# EAGLE design CoffeeRoaster (EAGLE 9.2.2)
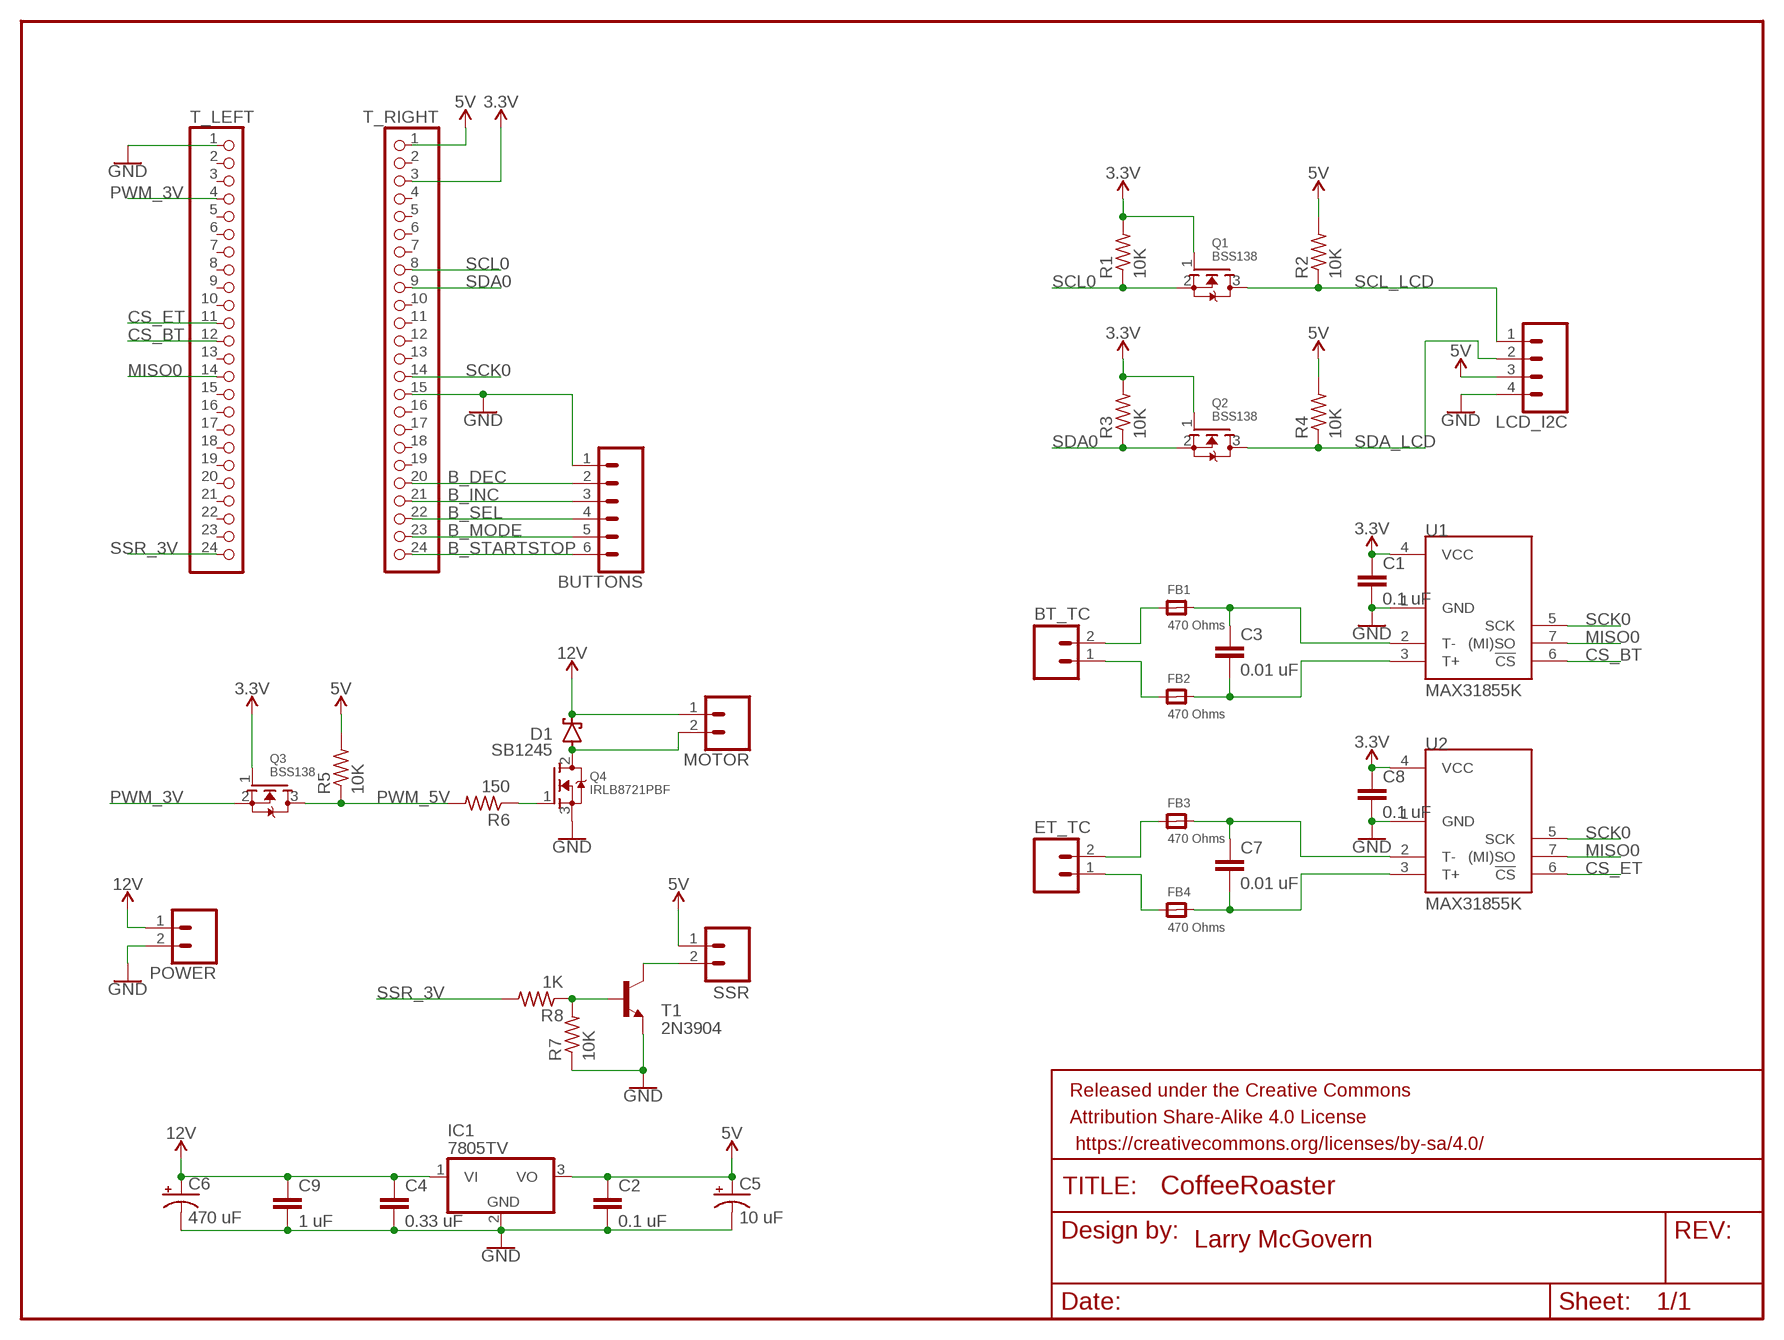
[diagram p0: schematic, sheet 1]

## Parts
BT_TC  M025MM  [SCREWTERMINAL-5MM-2]
BUTTONS  CONN_06SILK_FEMALE_PTH  [1X06]
C1  0.1 uF  C-EU050-025X075  [C050-025X075]
C2  0.1 uF  C-EU050-025X075  [C050-025X075]
C3  0.01 uF  C-EU050-025X075  [C050-025X075]
C4  0.33 uF  C-EU050-025X075  [C050-025X075]
C5  10 uF  CPOL-USE2.5-6  [E2,5-6]
C6  470 uF  CPOL-USE5-10.5  [E5-10,5]
C7  0.01 uF  C-EU050-025X075  [C050-025X075]
C8  0.1 uF  C-EU050-025X075  [C050-025X075]
C9  1 uF  C-EU050-025X075  [C050-025X075]
D1  SB1245  SCHOTTKY-DIODEDO201T15  [DO201T15]
ET_TC  M025MM  [SCREWTERMINAL-5MM-2]
FB1  470 Ohms  FERRITE_0805  [_0805]
FB2  470 Ohms  FERRITE_0805  [_0805]
FB3  470 Ohms  FERRITE_0805  [_0805]
FB4  470 Ohms  FERRITE_0805  [_0805]
FRAME1  FRAME-LETTER  [CREATIVE_COMMONS]
IC1  7805TV  [TO220V]
LCD_I2C  CONN_04  [1X04]
MOTOR  CONN_02PTH4  [1X02_XTRA_BIG]
POWER  CONN_02PTH4  [1X02_XTRA_BIG]
Q1  BSS138  MOSFET-NREFLOW  [SOT23]
Q2  BSS138  MOSFET-NREFLOW  [SOT23]
Q3  BSS138  MOSFET-NREFLOW  [SOT23]
Q4  IRLB8721PBF  MOSFET-NGDS_TO220V  [TO220V]
R1  10K  R-US_0207/10  [0207/10]
R2  10K  R-US_0207/10  [0207/10]
R3  10K  R-US_0207/10  [0207/10]
R4  10K  R-US_0207/10  [0207/10]
R5  10K  R-US_0207/10  [0207/10]
R6  150  R-US_0207/10  [0207/10]
R7  10K  R-US_0207/10  [0207/10]
R8  1K  R-US_0207/10  [0207/10]
SSR  M025MM  [SCREWTERMINAL-5MM-2]
T1  2N3904  [TO92]
T_LEFT  PINHD-1X24  [1X24]
T_RIGHT  PINHD-1X24  [1X24]
U1  MAX31855K  [SO08]
U2  MAX31855K  [SO08]

## Nets
3.3V: C1.1 C8.1 Q1.1(G) Q2.1(G) Q3.1(G) R1.2 R3.2 T_RIGHT.3 U1.4(VCC) U2.4(VCC)
5V: C2.1 C5.+ IC1.3(VO) LCD_I2C.3 R2.2 R4.2 R5.2 SSR.1 T_RIGHT.1
12V: C4.1 C6.+ C9.1 D1.C IC1.1(VI) MOTOR.1 POWER.1
B_DEC: BUTTONS.2 T_RIGHT.20
B_INC: BUTTONS.3 T_RIGHT.21
B_MODE: BUTTONS.5 T_RIGHT.23
B_SEL: BUTTONS.4 T_RIGHT.22
B_STARTSTOP: BUTTONS.6 T_RIGHT.24
CS_BT: T_LEFT.12 U1.6(!CS)
CS_ET: T_LEFT.11 U2.6(!CS)
GND: BUTTONS.1 C1.2 C2.2 C4.2 C5.- C6.- C8.2 C9.2 IC1.2(GND) LCD_I2C.4 POWER.2 Q4.3(S) R7.1 T1.3(E) T_LEFT.1 T_RIGHT.15 U1.1(GND) U2.1(GND)
MISO0: T_LEFT.14 U1.7((MI)SO) U2.7((MI)SO)
MOT_NEG: D1.A MOTOR.2 Q4.2(D)
N$1: Q4.1(G) R6.1
N$2: BT_TC.2 FB1.1
N$3: ET_TC.2 FB3.1
N$4: C3.1 FB1.2 U1.2(T-)
N$5: BT_TC.1 FB2.1
N$6: C3.2 FB2.2 U1.3(T+)
N$7: C7.1 FB3.2 U2.2(T-)
N$8: ET_TC.1 FB4.1
N$9: C7.2 FB4.2 U2.3(T+)
N$10: R7.2 R8.1 T1.2(B)
N$11: SSR.2 T1.1(C)
PWM_3V: Q3.2(S) T_LEFT.4
PWM_5V: Q3.3(D) R5.1 R6.2
SCK0: T_RIGHT.14 U1.5(SCK) U2.5(SCK)
SCL0: Q1.2(S) R1.1 T_RIGHT.8
SCL_LCD: LCD_I2C.1 Q1.3(D) R2.1
SDA0: Q2.2(S) R3.1 T_RIGHT.9
SDA_LCD: LCD_I2C.2 Q2.3(D) R4.1
SSR_3V: R8.2 T_LEFT.24
Unconnected: T_LEFT.2 T_LEFT.3 T_LEFT.5 T_LEFT.6 T_LEFT.7 T_LEFT.8 T_LEFT.9 T_LEFT.10 T_LEFT.13 T_LEFT.15 T_LEFT.16 T_LEFT.17 T_LEFT.18 T_LEFT.19 T_LEFT.20 T_LEFT.21 T_LEFT.22 T_LEFT.23 T_RIGHT.2 T_RIGHT.4 T_RIGHT.5 T_RIGHT.6 T_RIGHT.7 T_RIGHT.10 T_RIGHT.11 T_RIGHT.12 T_RIGHT.13 T_RIGHT.16 T_RIGHT.17 T_RIGHT.18 T_RIGHT.19

## Notes on the sheet
- Larry McGovern

## Library data of the parts
BT_TC ET_TC SSR = SparkFun-Connectors:M02: Standard 2-pin 0.1" header. Use with - straight break away headers ( PRT-00116) - right angle break away headers (PRT-00553) - swiss pins (PRT-00743) - machine pins (PRT-00117) - female headers (PRT-00115) Molex polarized connector foot print use with: PRT-08233 with associated crimp pins and housings. 2.54_SCREWTERM for use with PRT-10571. 3.5mm Screw Terminal footprints for PRT-08084 5mm Screw Terminal footprints for use with PRT-08432; STOREFRONT_ID: PRT-08432
BUTTONS = SparkFun-Connectors:CONN_06: Multi connection point. Often used as Generic Header-pin footprint for 0.1 inch spaced/style header connections On any of the 0.1 inch spaced packages, you can populate with these: Break Away Headers - Straight <https://www.sparkfun.com/products/116> (PRT-00116) Break Away Male Headers - Right Angle <https://www.sparkfun.com/products/553> (PRT-00553) Female Headers <https://www.sparkfun.com/products/115> (PRT-00115) Break Away Headers - Machine Pin <https://www.sparkfun.com/products/117> (PRT-00117) Break Away Female Headers - Swiss Machine Pin <https://www.sparkfun.com/products/743> (PRT-00743) Arduino Stackable Header - 6 Pin <https://www.sparkfun.com/products/9280> (PRT-09280) For SCREWTERMINALS and SPRING TERMINALS visit here: Screw Terimnals on SparkFun.com <https://www.sparkfun.com/search/results?term=Screw+Terminals> (5mm/3.5mm/2.54mm spacing) This device is also useful as a general connection point to wire up your design to another part of your project. Our various solder wires solder well into these plated through hole pads. Hook-Up Wire - Assortment (Stranded, 22 AWG) <https://www.sparkfun.com/products/11375> (PRT-11375) Hook-Up Wire - Assortment (Solid Core, 22 AWG) <https://www.sparkfun.com/products/11367> (PRT-11367) View the entire wire category on our website here <https://www.sparkfun.com/categories/141>; PROD_ID: CONN-08437
C1-C4 C7-C9 = resistor:C-EU: CAPACITOR, European symbol
C5 C6 = adafruit:CPOL-US: POLARIZED CAPACITOR, American symbol
D1 = diode:SCHOTTKY-DIODE: Schottky Diode
FB1-FB4 = microbuilder:FERRITE: Ferrite Bead 0603 MMZ1608B121C - 120 Ohm @ 100MHz, 600mA, 0.15 Ohm DC Resistance - Digikey: 445-2164-1-ND BK1608HW121-T - 120 Ohm, 600mA Ferrite Chip - Digikey: 587-1876-2-ND 0805 HZ0805B272R-10 - 2.7K Ohm @ 100MHz, 200mA, 0.8 Ohm DC Resistance - Digikey: 240-2504-1-ND (see also Murata BLM21BD272SN1L) MMZ2012Y152B - 1.5K Ohm @ 100MHz, 500mA, 0.4 Ohm DC Resistance - Digikey: 445-1560-1-ND - Mainly for high frequency (80-400MHz) MMZ2012R102A - 1K Ohm @ 100MHz, 500mA, 0.3 Ohm DC Resistance - Digikey: 445-1555-2-ND - More general purpose (10-200MHz)
FRAME1 = SparkFun-Aesthetics:FRAME-LETTER: Schematic Frame - Letter Standard 8.5x11 US Letter frame
IC1 = linear:78*: Positive VOLTAGE REGULATOR Source: http://cache.national.com/ds/LM/LM78L05.pdf http://www.fairchildsemi.com/ds/LM/LM7805.pdf
LCD_I2C = SparkFun-Connectors:CONN_04: Multi connection point. Often used as Generic Header-pin footprint for 0.1 inch spaced/style header connections On any of the 0.1 inch spaced packages, you can populate with these: Break Away Headers - Straight <https://www.sparkfun.com/products/116> (PRT-00116) Break Away Male Headers - Right Angle <https://www.sparkfun.com/products/553> (PRT-00553) Female Headers <https://www.sparkfun.com/products/115> (PRT-00115) Break Away Headers - Machine Pin <https://www.sparkfun.com/products/117> (PRT-00117) Break Away Female Headers - Swiss Machine Pin <https://www.sparkfun.com/products/743> (PRT-00743) For SCREWTERMINALS and SPRING TERMINALS visit here: Screw Terimnals on SparkFun.com <https://www.sparkfun.com/search/results?term=Screw+Terminals> (5mm/3.5mm/2.54mm spacing) This device is also useful as a general connection point to wire up your design to another part of your project. Our various solder wires solder well into these plated through hole pads. Hook-Up Wire - Assortment (Stranded, 22 AWG) <https://www.sparkfun.com/products/11375> (PRT-11375) Hook-Up Wire - Assortment (Solid Core, 22 AWG) <https://www.sparkfun.com/products/11367> (PRT-11367) View the entire wire category on our website here <https://www.sparkfun.com/categories/141> Special notes: Molex polarized connector foot print use with SKU : PRT-08231 with associated crimp pins and housings. 1MM SMD Version SKU: PRT-10208; PROD_ID: CONN-09696
MOTOR POWER = SparkFun-Connectors:CONN_02: Multi connection point. Often used as Generic Header-pin footprint for 0.1 inch spaced/style header connections On any of the 0.1 inch spaced packages, you can populate with these: Break Away Headers - Straight <https://www.sparkfun.com/products/116> (PRT-00116) Break Away Male Headers - Right Angle <https://www.sparkfun.com/products/553> (PRT-00553) Female Headers <https://www.sparkfun.com/products/115> (PRT-00115) Break Away Headers - Machine Pin <https://www.sparkfun.com/products/117> (PRT-00117) Break Away Female Headers - Swiss Machine Pin <https://www.sparkfun.com/products/743> (PRT-00743) For SCREWTERMINALS and SPRING TERMINALS visit here: Screw Terimnals on SparkFun.com <https://www.sparkfun.com/search/results?term=Screw+Terminals> (5mm/3.5mm/2.54mm spacing) This device is also useful as a general connection point to wire up your design to another part of your project. Our various solder wires solder well into these plated through hole pads. Hook-Up Wire - Assortment (Stranded, 22 AWG) <https://www.sparkfun.com/products/11375> (PRT-11375) Hook-Up Wire - Assortment (Solid Core, 22 AWG) <https://www.sparkfun.com/products/11367> (PRT-11367) View the entire wire category on our website here <https://www.sparkfun.com/categories/141> Special notes: Molex polarized connector foot print use with: PRT-08233 with associated crimp pins and housings. 2.54_SCREWTERM for use with PRT-10571. 3.5mm Screw Terminal footprints for PRT-08084 5mm Screw Terminal footprints for use with PRT-08432
Q1-Q4 = adafruit:MOSFET-N: N-Channel Mosfet 2N7002E - 60V 260mA SOT23 [Digikey: 2N7002ET1GOSTR-ND] - REEL BSH103 - 30V 850mA SOT23 [Digikey: 568-5013-1-ND]
R1-R8 = resistor:R-US_: RESISTOR, American symbol
T1 = transistor:2N3904: NPN TRANSISTOR
T_LEFT T_RIGHT = pinhead:PINHD-1X24: PIN HEADER
U1 U2 = SparkFun-IC-Conversion:MAX31855K: Cold-Junction-Compensated K-Thermocoupleto-Digital Converter (-270°C to +1800°C) The MAX31855K performs cold-junction compensation and digitizes the signal from a type-K thermocouple. The data is output in a 14-bit resolution, SPI™-compatible, read-only format. This converter resolves temperatures to 0.25°C, allows readings as high as +1800°C and as low as -270°C, and exhibits thermocouple accuracy of ±2°C for temperatures ranging from -200°C to +700°C for K-type thermocouples. Datasheet <https://cdn.sparkfun.com/datasheets/Sensors/Temp/MAX31855K.pdf> SparkFun Products SparkFun Thermocouple Breakout - MAX31855K <https://www.sparkfun.com/products/13266> (SEN-13266); PROD_ID: IC-12578

## Board
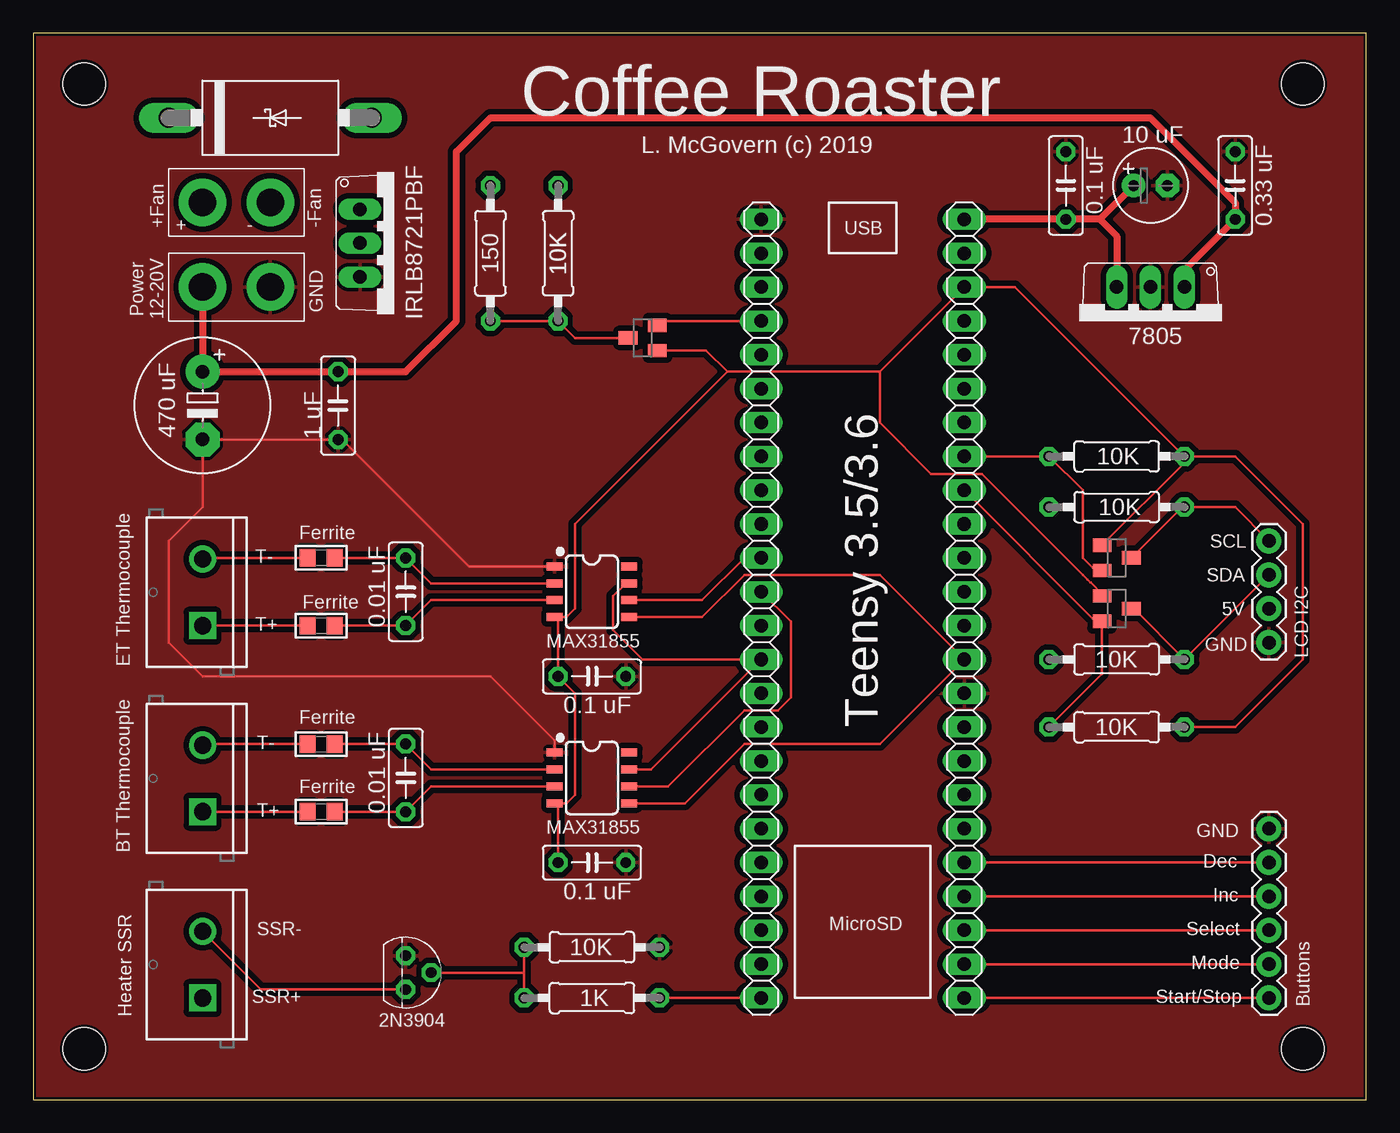
[diagram p1: board, top side]
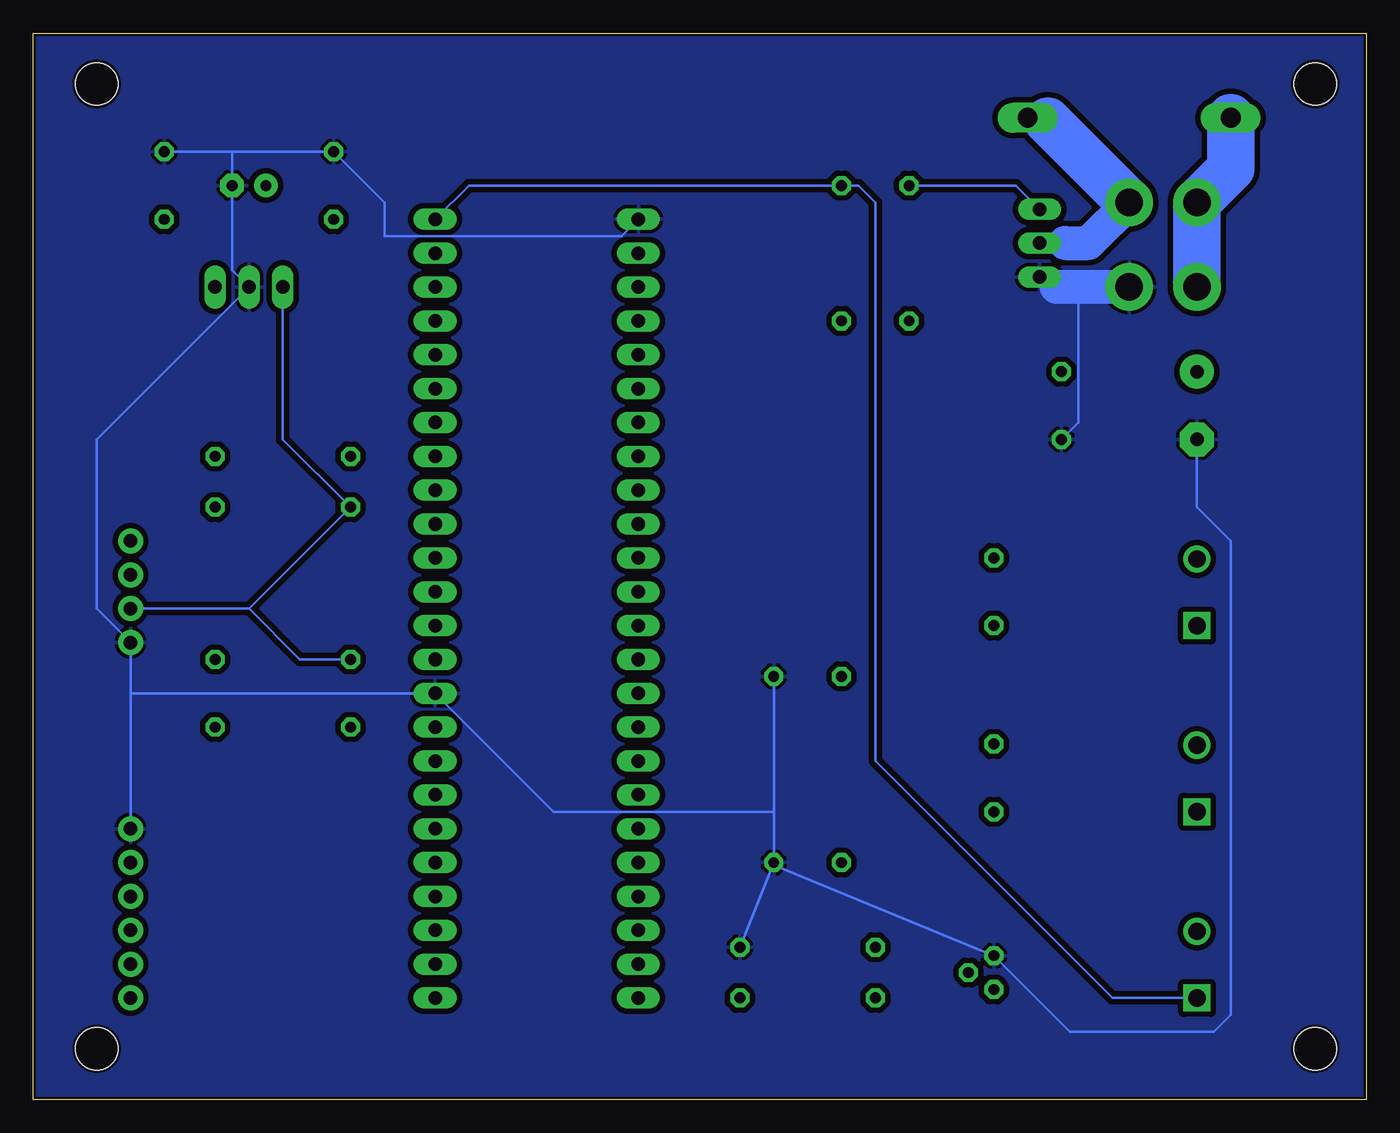
[diagram p2: board, bottom side, seen from below]

Size 100 x 80 mm. Coordinates in mm from the lower left corner, seen from the top.
Outline: 0,0 100,0 100,80 0,80 0,0
Copper layers (1*16): Top 0.035mm / dielectric 1.5mm / Bottom 0.035mm
Design rules "SparkFun_16mil_clearance": minimum track width 8mil, minimum drill 20mil, track to track 16mil, track to pad 12mil, pad to pad 8mil, via to via 8mil, smd to smd 8mil, copper to edge 8mil, drill to drill 8mil, minimum pad ring 12mil, minimum via ring 10mil, stop-mask expansion 4mil, vias tented up to drill 20mil, thermal gap 10mil
Holes 3.2 mm at 95.25,3.81 3.81,3.81 3.81,76.2 95.25,76.2

### Footprints (pad centres in the part's own frame; a part is rotated, then mirrored left to right if it is on the bottom)
SCREWTERMINAL-5MM-2 = drill 1.3 pad 2.032 square: 1 0,0 | drill 1.3 pad 2.032: 2 5,0
1X06 = drill 1.016 pad 1.88: 1 0,0; 2 2.54,0; 3 5.08,0; 4 7.62,0; 5 10.16,0; 6 12.7,0
C050-025X075 = drill 0.813 octagon: 1 -2.54,0; 2 2.54,0
E2,5-6 = drill 0.813 pad 1.778: + -1.27,0 | drill 0.813 pad 1.778 octagon: - 1.27,0
E5-10,5 = drill 1.016 pad 2.54: + -2.54,0 | drill 1.016 pad 2.54 octagon: - 2.54,0
DO201T15 = drill 1.499 long: A 7.62,0; C -7.62,0
_0805 = smd 1.2 x 1.3: 1 -1.016,0; 2 1.016,0
TO220V = drill 1.016 long: 1 -2.54,-2.54; 2 0,-2.54; 3 2.54,-2.54
1X04 = drill 1.016 pad 1.88: 1 0,0; 2 2.54,0; 3 5.08,0; 4 7.62,0
1X02_XTRA_BIG = drill 2.057 pad 3.556: 1 -2.54,0; 2 2.54,0
SOT23 = smd 1 x 1.4: 1 -0.95,-1.1; 2 0.95,-1.1; 3 0,1.1
0207/10 = drill 0.813 octagon: 1 -5.08,0; 2 5.08,0
TO92 = drill 0.813 octagon: 1 1.27,0; 2 0,1.905; 3 -1.27,0
1X24 = drill 1.016 long: 1 -29.21,0; 2 -26.67,0; 3 -24.13,0; 4 -21.59,0; 5 -19.05,0; 6 -16.51,0; 7 -13.97,0; 8 -11.43,0; 9 -8.89,0; 10 -6.35,0; 11 -3.81,0; 12 -1.27,0; 13 1.27,0; 14 3.81,0; 15 6.35,0; 16 8.89,0; 17 11.43,0; 18 13.97,0; 19 16.51,0; 20 19.05,0; 21 21.59,0; 22 24.13,0; 23 26.67,0; 24 29.21,0
SO08 = smd 0.6 x 1.2: 1 -1.905,-2.8; 2 -0.635,-2.8; 3 0.635,-2.8; 4 1.905,-2.8; 5 1.905,2.8; 6 0.635,2.8; 7 -0.635,2.8; 8 -1.905,2.8

### Placement (x,y rotation side)
BT_TC  12.7,21.59 90 top
BUTTONS  92.71,20.32 270 top
C1  41.91,31.75 0 top
C2  77.47,68.58 90 top
C3  27.94,24.13 270 top
C4  90.17,68.58 90 top
C5  83.82,68.58 0 top
C6  12.7,52.07 270 top
C7  27.94,38.1 270 top
C8  41.91,17.78 0 top
C9  22.86,52.07 270 top
D1  17.78,73.66 0 top
ET_TC  12.7,35.56 90 top
FB1  21.59,26.67 0 top
FB2  21.59,21.59 0 top
FB3  21.59,40.64 0 top
FB4  21.59,35.56 0 top
FRAME1  21.59,-8.89 0 top  (outside the outline)
IC1  83.82,58.42 180 top
LCD_I2C  92.71,41.91 270 top
MOTOR  15.24,67.31 0 top
POWER  15.24,60.96 0 top
Q1  81.28,40.64 270 top
Q2  81.28,36.83 270 top
Q3  45.72,57.15 90 top
Q4  27.05,64.26 270 top
R1  81.28,48.26 0 top
R2  81.28,44.45 180 top
R3  81.28,27.94 0 top
R4  81.28,33.02 180 top
R5  39.37,63.5 90 top
R6  34.29,63.5 270 top
R7  41.91,11.43 180 top
R8  41.91,7.62 0 top
SSR  12.7,7.62 90 top
T1  27.94,9.53 270 top
T_LEFT  54.61,36.83 270 top
T_RIGHT  69.85,36.83 270 top
U1  41.91,24.13 270 top
U2  41.91,38.1 270 top

### Tracks (layer width: path | path; a pad name or v marks a point on that pad's centre or on a via)
3.3V
  Top 0.203: Q1.1 86.36,47.77 R1.2 | R1.2 73.66,60.96 T_RIGHT.3 63.5,54.61 | 63.5,54.61 52.07,54.61 | 52.07,54.61 50.48,56.2 Q3.1 | C8.1 39.37,21.96 U1.4 40.01,22.23 40.64,22.86 40.64,30.48 C1.1 39.37,35.94 U2.4 40.01,36.2 40.64,36.83 40.64,43.18 52.07,54.61 | R1.2 90.17,48.26 95.25,43.18 95.25,33.02 90.17,27.94 R3.2 | 63.5,54.61 63.5,50.8 67.36,46.94 71.17,46.94 78.74,39.37 79.07,39.04 79.07,39.02 79.31,38.78 79.33,38.78 80.18,37.93 Q2.1
5V
  Top 0.508: C5.+ 80.01,66.04 | 80.01,66.04 C2.1 T_RIGHT.1 | 80.01,66.04 81.28,64.77 IC1.3
  Bottom 0.203: IC1.3 81.28,49.53 R2.2 83.82,36.83 | LCD_I2C.3 83.82,36.83 | 83.82,36.83 80.01,33.02 R4.2 | T_RIGHT.1 67.31,68.58 R5.2 38.1,68.58 36.83,67.31 36.83,52.07 36.83,25.4 19.05,7.62 SSR.1
12V
  Top 0.508: POWER.1 C6.+ C9.1 27.94,54.61 31.75,58.42 31.75,71.12 34.29,73.66 83.82,73.66 90.17,67.31 C4.1 86.36,62.23 IC1.1
  Bottom 3.556: POWER.1 MOTOR.1 10.16,69.85 D1.C
B_DEC
  Top 0.203: T_RIGHT.20 BUTTONS.2
B_INC
  Top 0.203: T_RIGHT.21 BUTTONS.3
B_MODE
  Top 0.203: T_RIGHT.23 BUTTONS.5
B_SEL
  Top 0.203: T_RIGHT.22 BUTTONS.4
B_STARTSTOP
  Top 0.203: T_RIGHT.24 BUTTONS.6
CS_BT
  Top 0.203: U1.6 47.62,23.5 53.34,29.21 55.88,29.21 56.83,30.16 56.83,35.88 T_LEFT.12
CS_ET
  Top 0.203: U2.6 50.16,37.47 53.34,40.64 T_LEFT.11
GND
  Top 0.203: U2.1 32.7,40.01 23.18,49.53 C9.2 C6.- 12.7,44.45 10.16,41.91 10.16,34.29 12.7,31.75 34.29,31.75 39.11,26.93 U1.1
  Bottom 0.203: Q4.3 24.45,61.59 24.13,61.59 23.24,60.96 | 21.59,60.96 21.59,50.8 C9.2 | 85.09,71.12 C2.2 73.66,67.31 73.66,64.77 55.88,64.77 T_LEFT.1 | 85.09,71.12 C5.- 85.09,62.23 IC1.2 95.25,49.53 95.25,36.83 LCD_I2C.4 92.71,30.48 | 92.71,30.48 T_RIGHT.15 60.96,21.59 44.45,21.59 | 92.71,30.48 BUTTONS.1 | C1.2 44.45,21.59 | 44.45,21.59 C8.2 | 85.09,71.12 C4.2 | C6.- 12.7,44.45 10.16,41.91 10.16,6.35 11.43,5.08 22.23,5.08 T1.3 44.13,17.46 C8.2 | C8.2 R7.1
  Bottom 2.54: POWER.2 21.59,60.96 23.24,60.96
  pour Top: 0,0 0,80.01 99.95,80.01 99.95,0
  pour Bottom: 0,0 0,80.01 99.95,80.01 99.95,0
MISO0
  Top 0.203: U1.7 46.35,24.77 T_LEFT.14 45.72,33.02 43.5,35.24 43.5,37.78 44.45,38.73 U2.7
MOT_NEG
  Bottom 0.203: Q4.2 22.61,64.26 | 23.88,73.41 24.13,73.66 D1.A
  Bottom 2.54: MOTOR.2 20.83,64.26 22.61,64.26
  Bottom 3.556: MOTOR.2 23.88,73.41
N$1
  Bottom 0.203: Q4.1 26.29,68.58 R6.1
N$2
  Top 0.203: FB1.1 12.78,26.67 BT_TC.2
N$3
  Top 0.203: FB3.1 12.78,40.64 ET_TC.2
N$4
  Top 0.203: U1.2 29.84,24.77 C3.1 FB1.2
N$5
  Top 0.203: FB2.1 BT_TC.1
N$6
  Top 0.203: U1.3 29.84,23.5 C3.2 FB2.2
N$7
  Top 0.203: U2.2 29.84,38.73 C7.1 FB3.2
N$8
  Top 0.203: FB4.1 ET_TC.1
N$9
  Top 0.203: U2.3 29.84,37.47 C7.2 FB4.2
N$10
  Top 0.203: R8.1 36.83,9.53 | 36.83,9.53 R7.2 | T1.2 36.83,9.53
N$11
  Top 0.203: T1.1 17.07,8.26 SSR.2
PWM_3V
  Top 0.203: T_LEFT.4 47.14,58.42 Q3.2
PWM_5V
  Top 0.203: Q3.3 40.64,57.15 R5.1 R6.2
SCK0
  Top 0.203: U1.5 48.9,22.23 53.34,26.67 63.5,26.67 T_RIGHT.14 63.5,39.37 53.34,39.37 50.16,36.2 U2.5
SCL0
  Top 0.203: T_RIGHT.8 R1.1 78.74,45.72 78.74,40.64 79.69,39.69 Q1.2
SCL_LCD
  Top 0.203: Q1.3 86.19,44.45 R2.1 90.17,44.45 LCD_I2C.1
SDA0
  Top 0.203: T_RIGHT.9 79.69,35.88 Q2.2 80.18,31.92 R3.1
SDA_LCD
  Top 0.203: Q2.3 82.55,36.83 R4.1 LCD_I2C.2
SSR_3V
  Top 0.203: T_LEFT.24 R8.2

### Text on the board
tPlace: Coffee Roaster | 10 uF | L. McGovern (c) 2019 | 0.1 uF | 0.33 uF | +Fan | + | - | -Fan | USB | 150 | 10K | 10K | Power / 12-20V | GND | IRLB8721PBF | 7805 | 470 uF | 1 uF | 10K | 10K | Ferrite | SCL | T- | SDA | Ferrite | 5V | T+ | 0.01 uF | MAX31855 | GND | ET Thermocouple | LCD I2C | 10K | 0.1 uF | Ferrite | Teensy 3.5/3.6 | 10K | T- | Ferrite | T+ | 0.01 uF | MAX31855 | GND | BT Thermocouple | Dec | 0.1 uF | Inc | MicroSD | SSR- | 10K | Select | Mode | 1K | SSR+ | Start/Stop | Buttons | Heater SSR | 2N3904